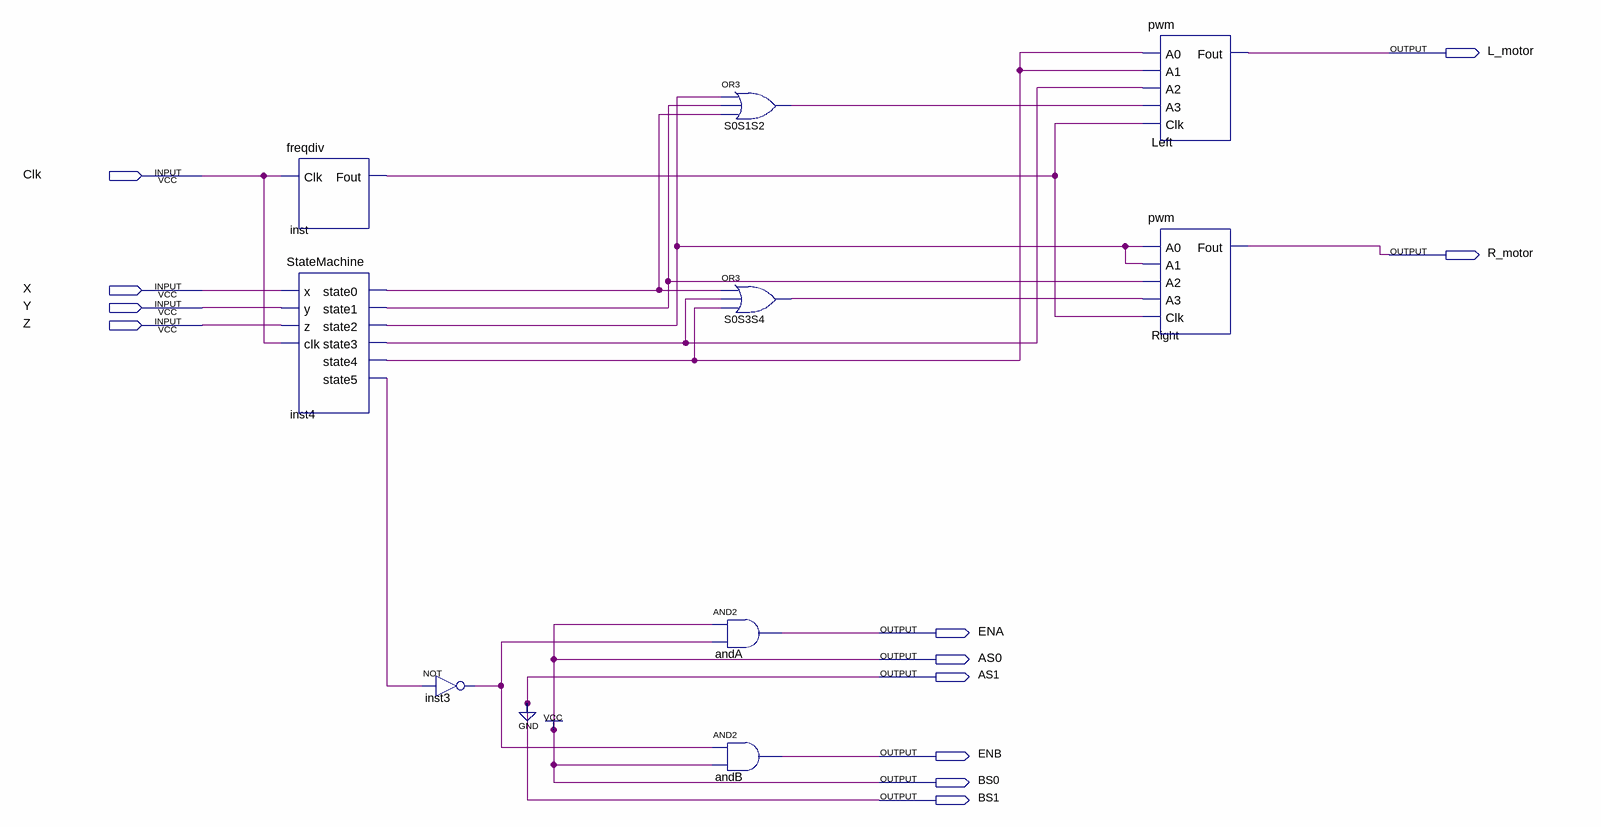
[diagram p0: schematic sheet]
// Quartus schematic robot.bdf as structural Verilog: 9 symbols, 12 pins
module robot (
  input  Clk,
  input  X,
  input  Y,
  input  Z,
  output L_motor,
  output R_motor,
  output ENA,
  output AS0,
  output AS1,
  output ENB,
  output BS0,
  output BS1
);

  wire inst3_out, inst4_state0, inst4_state1, inst4_state2, inst4_state3, inst4_state4, inst4_state5,
       inst_fout, S0S1S2_out, S0S3S4_out;

  freqdiv inst (.Clk(Clk), .Fout(inst_fout));
  StateMachine inst4 (
    .x(X), .y(Y), .z(Z), .clk(Clk), .state0(inst4_state0), .state1(inst4_state1), .state2(inst4_state2),
    .state3(inst4_state3), .state4(inst4_state4), .state5(inst4_state5));
  not inst3 (inst3_out, inst4_state5);
  or S0S1S2 (S0S1S2_out, inst4_state2, inst4_state1, inst4_state0);
  or S0S3S4 (S0S3S4_out, inst4_state0, inst4_state3, inst4_state4);
  and andA (ENA, 1'b1, inst3_out);
  and andB (ENB, inst3_out, 1'b1);
  pwm Left (.A0(inst4_state4), .A1(inst4_state4), .A2(inst4_state3), .A3(S0S1S2_out), .Clk(inst_fout), .Fout(L_motor));
  pwm Right (.A0(inst4_state2), .A1(inst4_state2), .A2(inst4_state1), .A3(S0S3S4_out), .Clk(inst_fout), .Fout(R_motor));

  assign AS0 = 1'b1;
  assign AS1 = 1'b0;
  assign BS0 = 1'b1;
  assign BS1 = 1'b0;
endmodule
